# Altium project DClassAmp.PrjPcb (part 1 of 2)
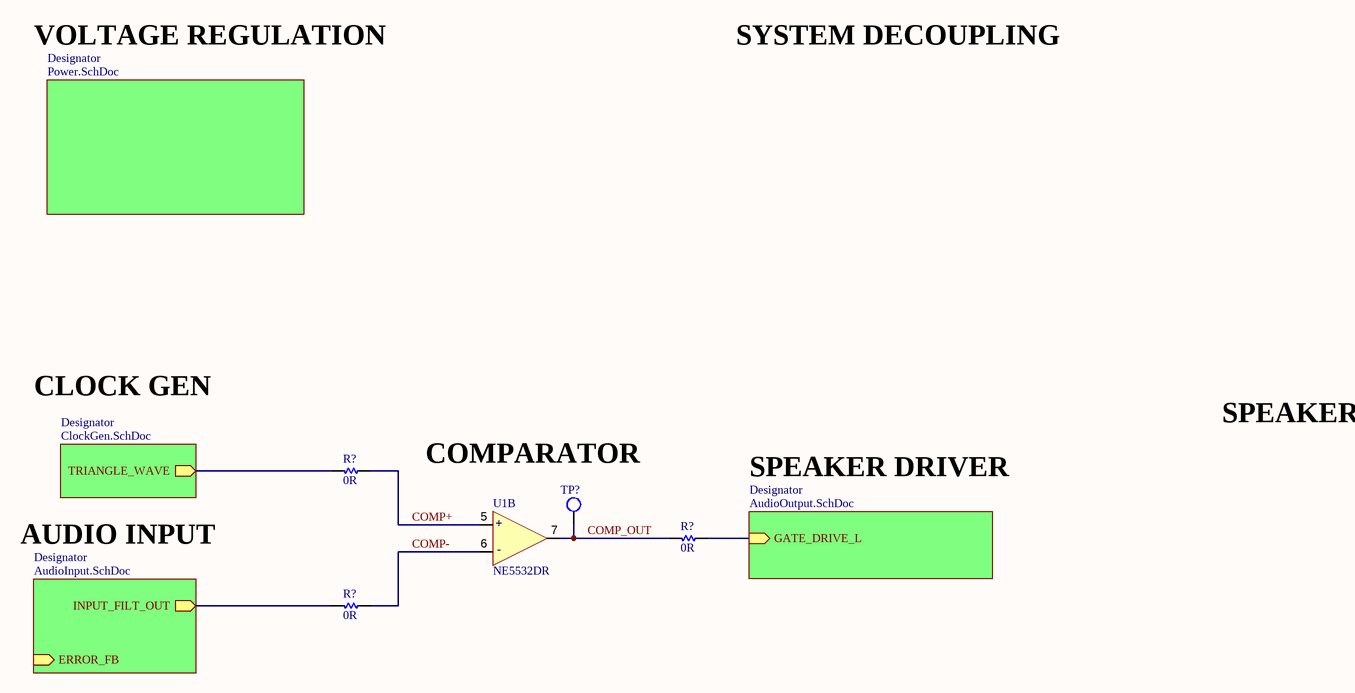
[diagram p0: DClassAmp.SchDoc]
5 sheets, 100 parts. Net scope: hierarchical (ports join the sheet entries above them; power ports are global).
Sheets:
  DClassAmp.SchDoc
    Designator = AudioInput.SchDoc
    Designator = ClockGen.SchDoc
    Designator = AudioOutput.SchDoc
    Designator = Power.SchDoc

## Sheet DClassAmp.SchDoc: D Class Amplifier
size 431 x 279 mm; CheckedBy: K.Heyer; DrawnBy: K.Heyer; Organization: ORGANIZATION; Address1: 207; Address2: 13399 104 Ave; Address3: Surrey BC, V3T 0C9; Address4: Canada; Revision: V0.0.0; SheetNumber: 1; SheetTotal: 5; Project: D Class Amp; ENG_APP_DATE: --/--/--; DSN_APP_DATE: --/--/--; CHK_APP_DATE: --/--/--

### Parts
(Parts that share a designator on the sheet are numbered #1, #2 ... from top to bottom, then left to right.)
R?#1  0R  [R0402]
R?#2  0R  [R0402]
R?#3  0R  [R0402]
TP?#1  1mm  [TESTPOINT_SMT]  (value not drawn)
U1  NE5532DR  [SO8 6.2x5mm TI D0008A]  (part B of 2)

### Sub-sheets
Designator = AudioInput.SchDoc: INPUT_FILT_OUT (out), ERROR_FB (in)
Designator = ClockGen.SchDoc: TRIANGLE_WAVE (out)
Designator = AudioOutput.SchDoc: GATE_DRIVE_L (in)
Designator = Power.SchDoc: no entries

### Nets
COMP+: R?#1.1 U1.5(+)
COMP-: R?#3.1 U1.6(-)
COMP_OUT: R?#2.2 TP?#1.1 U1.7
INPUT_FILT_OUT: R?#3.2 ; sheet Designator/INPUT_FILT_OUT
TRIANGLE_WAVE: R?#1.2 ; sheet Designator/TRIANGLE_WAVE
NetC?#24_2: R?#2.1 ; sheet Designator/GATE_DRIVE_L

### Notes on the sheet
- VOLTAGE REGULATION
- SYSTEM DECOUPLING
- CLOCK GEN
- COMPARATOR
- SPEAKER DRIVER
- SPEAKER
- AUDIO INPUT
- REV:
- PROJECT:
- DATE:
- TITLE
- SHEET
- OF
- DESIGNED:
- REVIEWED:

### Library data of the parts
R?#1-R?#3 = RES 0R 63mW 0402: GLOVE, POLYAMIDE, L/FREE, PU, SIZE 6 - More Details; Manufacturer: Stackpole Electronics; Manufacturer Part Number: RMCF0402ZT0R00; Power Rating: 63mW; Current Rating: 1A; Working Voltage: 50V; Supplier 1: Digi-Key; RoHS: Yes; Category: Chip SMD Resistors; Stock 1: 5203223; Pricing 1: 1=0.10000, 10=0.01000, 25=0.00720, 50=0.00560, 100=0.00410, 250=0.00316, 500=0.00252, 1000=0.00186, 5000=0.00133 (USD); Mount: Surface Mount; Case/Package: 0402; Case Code (Metric): 1005; Case Code (Imperial): 0402; Contact Plating: Tin,Matte; Min Operating Temperature: -55°C; Max Operating Temperature: 155°C; Resistance: 0R; Packaging: Tape and Reel; Resistor Type: Thick Film; Number of Terminations: 2; Max Power Dissipation: 63mW; Features: Automotive AEC-Q200; Series: RMCF; Technology: THICK FILM; Construction: Rectangular; Length: 0.039inch; Width: 0.02inch; Height: 0.016inch; Depth: 0.5mm; Radiation Hardening: No; Military Standard: Not; Lead Free: Lead Free; RoHS Compliant: Yes; ComponentLink1URL: https://datasheet.ciiva.com/26835/getdatasheetpartid-409751-26835612.pdf?src-supplier=Verical; ComponentLink1Description: https://datasheet.ciiva.com/26835/getdatasheetpartid-409751-26835612.pdf?src-supplier=Verical; Supplier Part Number 1: RMCF0402ZT0R00CT-ND
TP?#1 = TP 1mm: SMT testpoint
U1 = IC OPAMP AUDIO NE5532DR: 2-channel, 10-MHz, 26-V output swing, low-noise audio op amp 8-SOIC 0 to 70; Manufacturer: Texas Instruments; Voltage Gain: 100dB; Min Dual Supply Voltage: 5V; Max Dual Supply Voltage: 15V; Output Current: 38mA; Nominal Supply Current: 16mA; Common Mode Rejection Ratio: 70dB; Number of Channels: 2; Slew Rate: 9V/µs; Gain Bandwidth Product: 10MHz; Input Bias Current: 800nA; Input Offset Voltage (Vos): 4mV; Operating Supply Current: 8mA; Dual Supply Voltage: 9V; Supplier 1: Digi-Key; Manufacturer Part Number: NE5532DR; RoHS: Yes; Category: Amplifiers - Op Amps, Buffer, Instrumentation; Stock 1: 29111; Pricing 1: 1=0.60000, 10=0.51300, 25=0.47840, 100=0.38290, 250=0.35552, 500=0.30082, 1000=0.23246 (USD); Case/Package: D; Number of Pins: 8; Contact Plating: Gold; Min Operating Temperature: 0°C; Max Operating Temperature: 70°C; Packaging: Tape and Reel; Package Quantity: 1; Number of Circuits: 2; Output Current per Channel: 38mA; Nominal Gain Bandwidth Product: 10MHz; Unity Gain Bandwidth Product: 10MHz; Number of Elements: 2; Bandwidth: 10MHz; Max I/O Voltage: 4mV; Max Supply Voltage: 15V; Number of Amplifiers: 2; Length: 4.9mm; Width: 3.91mm; Height: 1.58mm; Radiation Hardening: No; Lead Free: Lead Free; RoHS Compliant: Yes; REACH SVHC: No SVHC; ComponentLink1URL: https://datasheet.ciiva.com/1796/ne5532-1796190.pdf?src-supplier=Digi-Key; ComponentLink1Description: https://datasheet.ciiva.com/1796/ne5532-1796190.pdf?src-supplier=Digi-Key; ComponentLink2URL: https://datasheet.ciiva.com/1796/ne5532-1796189.pdf?src-supplier=Digi-Key; ComponentLink2Description: https://datasheet.ciiva.com/1796/ne5532-1796189.pdf?src-supplier=Digi-Key; ComponentLink3URL: https://datasheet.ciiva.com/1796/ne5532-1796191.pdf?src-supplier=Digi-Key; ComponentLink3Description: https://datasheet.ciiva.com/1796/ne5532-1796191.pdf?src-supplier=Digi-Key; Supplier Part Number 1: 296-13622-1-ND

## Sheet AudioInput.SchDoc
size 431 x 279 mm; Organization: ORGANIZATION; Address1: 207; Address2: 13399 104 Ave; Address3: Surrey BC, V3T 0C9; Address4: Canada; Revision: V0.0.0; SheetNumber: 3; SheetTotal: 5; ENG_APP_DATE: --/--/--; DSN_APP_DATE: --/--/--; CHK_APP_DATE: --/--/--
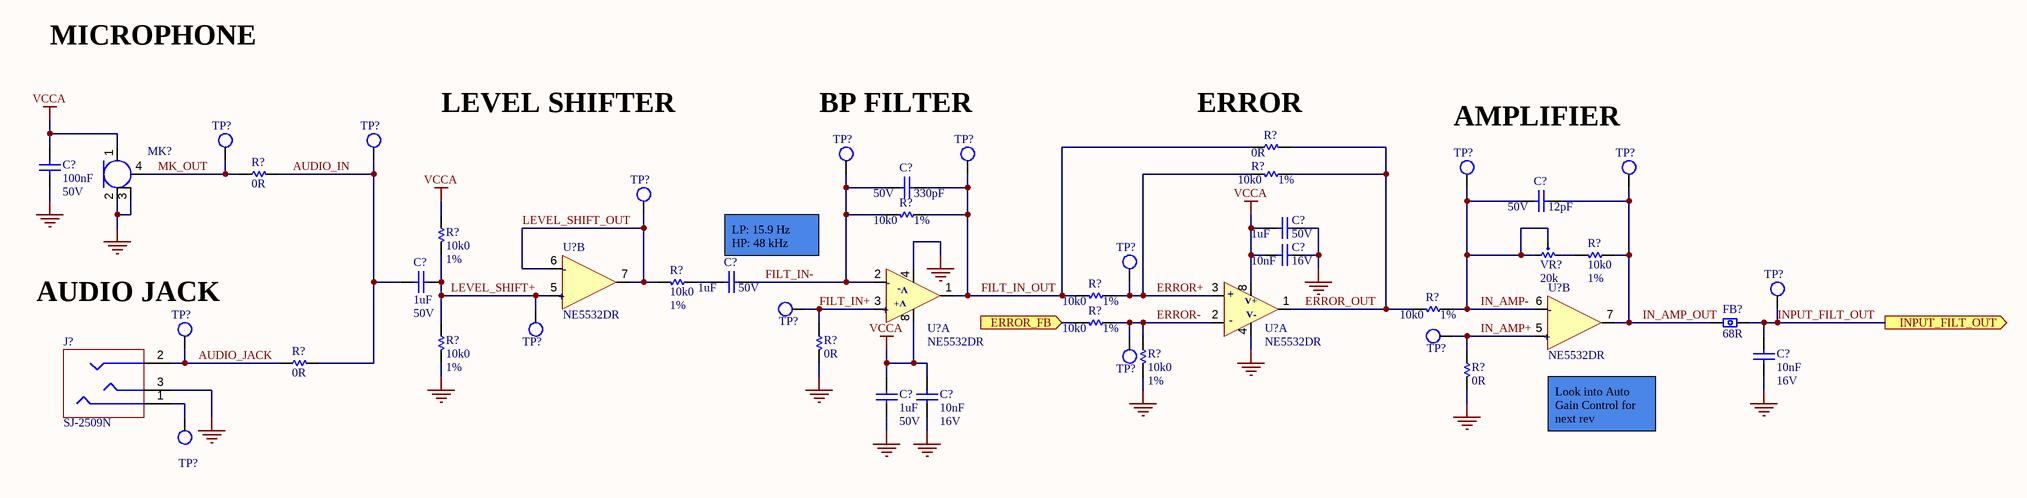
[diagram p1: AudioInput.SchDoc]

### Parts
(Parts that share a designator on the sheet are numbered #1, #2 ... from top to bottom, then left to right.)
C?#1  100nF  Voltage Rating: 50V  [C1206]
C?#2  330pF  Voltage Rating: 50V  [c0402]
C?#3  12pF  Voltage: 50V  [C0402]
C?#4  1uF  Voltage Rating: 50V
C?#5  10nF  Voltage Rating: 16V  [c0402]
C?#6  1uF  Voltage Rating: 50V
C?#7  1uF  Voltage Rating: 50V
C?#8  10nF  Voltage Rating: 16V  [c0402]
C?#9  1uF  Voltage Rating: 50V
C?#10  10nF  Voltage Rating: 16V  [c0402]
FB?  68R  [FB0402]
J?  SJ-2509N  [CONN SPKR JACK SJ-2509N]
MK?  CMM-2718AT-42308-TR  [MICROPHONE MEMS SMD CMM-2718AT-42308-TR]  (value not drawn)
R?#4  0R  [R0402]
R?#5  0R  [R0402]
R?#6  10k0  Tolerance: 1%  [r0402]
R?#7  10k0  Tolerance: 1%  [r0402]
R?#8  10k0  Tolerance: 1%  [r0402]
R?#9  10k0  Tolerance: 1%  [r0402]
R?#10  10k0  Tolerance: 1%  [r0402]
R?#11  10k0  Tolerance: 1%  [r0402]
R?#12  10k0  Tolerance: 1%  [r0402]
R?#13  10k0  Tolerance: 1%  [r0402]
R?#14  10k0  Tolerance: 1%  [r0402]
R?#15  0R  [R0402]
R?#16  10k0  Tolerance: 1%  [r0402]
R?#17  0R  [R0402]
R?#18  0R  [R0402]
TP?#2  1mm  [TESTPOINT_SMT]  (value not drawn)
TP?#3  1mm  [TESTPOINT_SMT]  (value not drawn)
TP?#4  1mm  [TESTPOINT_SMT]  (value not drawn)
TP?#5  1mm  [TESTPOINT_SMT]  (value not drawn)
TP?#6  1mm  [TESTPOINT_SMT]  (value not drawn)
TP?#7  1mm  [TESTPOINT_SMT]  (value not drawn)
TP?#8  1mm  [TESTPOINT_SMT]  (value not drawn)
TP?#9  1mm  [TESTPOINT_SMT]  (value not drawn)
TP?#10  1mm  [TESTPOINT_SMT]  (value not drawn)
TP?#11  1mm  [TESTPOINT_SMT]  (value not drawn)
TP?#12  1mm  [TESTPOINT_SMT]  (value not drawn)
TP?#13  1mm  [TESTPOINT_SMT]  (value not drawn)
TP?#14  1mm  [TESTPOINT_SMT]  (value not drawn)
TP?#15  1mm  [TESTPOINT_SMT]  (value not drawn)
TP?#16  1mm  [TESTPOINT_SMT]  (value not drawn)
U?#1  NE5532DR  [SO8 6.2x5mm TI D0008A]  (part B of 2)
U?#2  NE5532DR  [SO8 6.2x5mm TI D0008A]  (part A of 2)
U?#3  NE5532DR  [SO8 6.2x5mm TI D0008A]  (part A of 2)
U?#4  NE5532DR  [SO8 6.2x5mm TI D0008A]  (part B of 2)
VR?#1  20k  [RV TC33X-2]

### Ports
ERROR_FB (in), INPUT_FILT_OUT (out)

### Nets
GND: C?#1.1 C?#4.1 C?#5.1 C?#8.1 C?#9.1 C?#10.1 J?.3 MK?.2 MK?.3 R?#14.2 R?#15.2 R?#16.2 R?#18.2 U?#2.4(V-) U?#3.4(V-)
VCCA: C?#1.2 C?#4.2 C?#5.2 C?#9.2 C?#10.2 MK?.1 R?#8.1 U?#2.8(V+) U?#3.8(V+)
AUDIO_IN: C?#6.2 R?#5.2 R?#17.2 TP?#3.1
AUDIO_JACK: J?.2 R?#17.1 TP?#15.1
ERROR+: R?#6.2 R?#11.1 TP?#9.1 U?#3.3(+)
ERROR-: R?#13.1 R?#16.1 TP?#13.1 U?#3.2(-)
ERROR_OUT: R?#4.2 R?#6.1 R?#12.2 U?#3.1
FILT_IN+: R?#15.1 TP?#11.1 U?#2.3(+)
FILT_IN-: C?#2.2 C?#7.1 R?#7.2 TP?#4.1 U?#2.2(-)
FILT_IN_OUT: C?#2.1 R?#4.1 R?#7.1 R?#11.2 TP?#5.1 U?#2.1
IN_AMP+: R?#18.1 TP?#14.1 U?#4.5(+)
IN_AMP-: C?#3.2 R?#12.1 TP?#6.1 U?#4.6(-) VR?#1.1 VR?#1.3
IN_AMP_OUT: C?#3.1 FB?.1 R?#9.1 TP?#7.1 U?#4.7
INPUT_FILT_OUT: C?#8.2 FB?.2 TP?#12.1 ; port INPUT_FILT_OUT
LEVEL_SHIFT+: C?#6.1 R?#8.2 R?#14.1 TP?#10.1 U?#1.5(+)
LEVEL_SHIFT_OUT: R?#10.2 TP?#8.1 U?#1.6(-) U?#1.7
MK_OUT: MK?.4 R?#5.1 TP?#2.1
NetC?#7_2: C?#7.2 R?#10.1
NetJ?_1: J?.1 TP?#16.1
NetR?#9_2: R?#9.2 VR?#1.3
NetR?#13_2: R?#13.2 ; port ERROR_FB

### Notes on the sheet
- MICROPHONE
- LEVEL SHIFTER
- (near TP?#4) BP FILTER
- (near R?#4) ERROR
- (near TP?#6) AMPLIFIER
- (near C?#7) LP: 15.9 Hz
  HP: 48 kHz
- (near TP?#15) AUDIO JACK
- (near U?#4) Look into Auto Gain Control for next rev
- REV:
- PROJECT:
- DATE:
- TITLE
- SHEET
- OF
- DESIGNED:
- REVIEWED:

### Library data of the parts
C?#1 = CAP CER 100nF 50V X7R 1206: Capacitor, ceramic, 100Nf, 50Vdc, 10-% Tol, 10+% Tol, x7R-Tc Code, -15, 15%-Tc Rohs Compliant: Yes; Manufacturer: KEMET; Manufacturer Part Number: C1206C104K5RAC7210; Tolerance: 10%; Dielectric: X7R; Supplier 1: Digi-Key; RoHS: Yes; Category: Ceramic Capacitors; Stock 1: 510000; Pricing 1: 10000=0.01725 (USD); Mount: Surface Mount; Case/Package: 1206; Case Code (Imperial): 1206; Case Code (Metric): 3216; Dielectric Material: Ceramic; Min Operating Temperature: -55°C; Max Operating Temperature: 125°C; Capacitance: 100nF; Packaging: Tape and Reel; Package Quantity: 10000; Voltage Rating (DC): 50V; Termination: SMD/SMT; Series: C; Construction: Flat; Length: 3.2mm; Width: 1.6mm; Height: 0.78mm; Depth: 1.6mm; Thickness: 0.035inch; Radiation Hardening: No; RoHS Compliant: Yes; ComponentLink1URL: https://datasheet.ciiva.com/16623/datasheetpn-c1206c104k5rac7210-16623777.pdf?src-supplier=Avnet+Europe; ComponentLink1Description: https://datasheet.ciiva.com/16623/datasheetpn-c1206c104k5rac7210-16623777.pdf?src-supplier=Avnet+Europe; ComponentLink2URL: https://datasheet.ciiva.com/18194/getdatasheetpartid-94372-18194154.pdf?src-supplier=Verical; ComponentLink2Description: https://datasheet.ciiva.com/18194/getdatasheetpartid-94372-18194154.pdf?src-supplier=Verical; Supplier Part Number 1: 399-7357-2-ND
C?#2 = CAP CER 330pF 50V C0G 0402: Multilayer Ceramic Capacitor, 330 pF, 5%, C0G / NP0, 50 V, 0402 [1005 Metric] RoHS Compliant: Yes; Manufacturer: Walsin Technologies; Manufacturer Part Number: 0402N331J500CT; Supplier 1: Digi-Key; RoHS: Yes; Category: Ceramic Capacitors; Stock 1: 670585; Pricing 1: 1=0.10000, 10=0.02700, 50=0.01460, 100=0.01190, 500=0.00848, 1000=0.00666, 2500=0.00605, 5000=0.00557 (USD); Case/Package: 0402; Case Code (Metric): 1005; Case Code (Imperial): 0402; Min Operating Temperature: -55°C; Max Operating Temperature: 125°C; Tolerance: 5%; Packaging: Tape and Reel; Capacitance: 330pF; Dielectric: C0G; Voltage Rating (DC): 50V; Length: 1mm; Depth: 0.5mm; REACH SVHC: Unknown; RoHS Compliant: Yes; ComponentLink1URL: http://www.farnell.com/datasheets/1958513.pdf?src-supplier=Farnell; ComponentLink1Description: http://www.farnell.com/datasheets/1958513.pdf?src-supplier=Farnell; ComponentLink2URL: http://www.farnell.com/datasheets/2340522.pdf?src-supplier=Farnell; ComponentLink2Description: http://www.farnell.com/datasheets/2340522.pdf?src-supplier=Farnell; ComponentLink3URL: http://components.arrow.com/part/dataview/0323_03460079?src-supplier=Arrow+Europe; ComponentLink3Description: http://components.arrow.com/part/dataview/0323_03460079?src-supplier=Arrow+Europe; ComponentLink4URL: http://www.farnell.com/datasheets/1958513.pdf?src-supplier=Element14; ComponentLink4Description: http://www.farnell.com/datasheets/1958513.pdf?src-supplier=Element14; ComponentLink5URL: http://www.passivecomponent.com/wp-content/uploads/2018/10/MLCC.pdf?src-supplier=Digi-Key; ComponentLink5Description: http://www.passivecomponent.com/wp-content/uploads/2018/10/MLCC.pdf?src-supplier=Digi-Key; Supplier Part Number 1: 1292-1308-1-ND
C?#3 = CAP CER 12pF 50V C0G 0402: Ceramic capacitor SMD-0402 12pF /50V C0G# J +-5%, Samsung, RoHS; Manufacturer Part Number: CL05C120JB5NNNC; Tolerance: 5%; Dielectric: C0G; Temperature Coefficient: 300ppm/°C; Supplier 1: Digi-Key; Manufacturer: Samsung; RoHS: Yes; Category: Ceramic Capacitors; Stock 1: 41998; Pricing 1: 10000=0.00386, 20000=0.00367 (USD); Mount: Surface Mount; Case/Package: 0402; Case Code (Metric): 1005; Case Code (Imperial): 0402; Material: Ceramic; Contact Plating: Tin; Min Operating Temperature: -55°C; Max Operating Temperature: 125°C; Capacitance: 12pF; Package Quantity: 1; Packaging: Tape and Reel; Voltage Rating: 50V; Series: CL; Construction: Flat; Voltage Rating (DC): 50V; Length: 1mm; Width: 0.02inch; Height: 0.5mm; Thickness: 0.022inch; Depth: 0.5mm; Radiation Hardening: No; RoHS Compliant: Yes; Lead Free: Lead Free; ComponentLink1URL: https://datasheet.ciiva.com/25806/cl05c120jb5nnnc-25806484.pdf?src-supplier=Digi-Key; ComponentLink1Description: https://datasheet.ciiva.com/25806/cl05c120jb5nnnc-25806484.pdf?src-supplier=Digi-Key; ComponentLink2URL: https://datasheet.ciiva.com/26838/getdatasheetpartid-658047-26838280.pdf?src-supplier=Verical; ComponentLink2Description: https://datasheet.ciiva.com/26838/getdatasheetpartid-658047-26838280.pdf?src-supplier=Verical; ComponentLink3URL: https://datasheet.ciiva.com/29198/458703-da-01-en-vs-kondensator-0402-29198421.pdf?src-supplier=Conrad; ComponentLink3Description: https://datasheet.ciiva.com/29198/458703-da-01-en-vs-kondensator-0402-29198421.pdf?src-supplier=Conrad; ComponentLink4URL: https://datasheet.ciiva.com/16449/cl05b104kq5nnnc-16449055.pdf?src-supplier=Future+Electronics; ComponentLink4Description: https://datasheet.ciiva.com/16449/cl05b104kq5nnnc-16449055.pdf?src-supplier=Future+Electronics; Supplier Part Number 1: 1276-1178-2-ND
C?#4 C?#6 C?#7 C?#9 = CAP CER 1uF 50V X5R 0603: Multilayer Ceramic Capacitors (High dielectric type), 50V, 1 uF, ± 10 %, 0603, X5R, RoHS; Manufacturer: Taiyo Yuden; Manufacturer Part Number: UMK107BJ105KA-T; Tolerance: 10%; Supplier 1: Digi-Key; RoHS: Yes; Category: Ceramic Capacitors; Stock 1: 955108; Pricing 1: 1=0.19000, 10=0.12900, 50=0.07760, 100=0.06560, 500=0.04484, 1000=0.03968 (USD); Mount: Surface Mount; Case/Package: 0603; Number of Pins: 2; Case Code (Metric): 1608; Case Code (Imperial): 0603; Contact Plating: Nickel; Min Operating Temperature: -55°C; Max Operating Temperature: 85°C; Capacitance: 1uF; Packaging: Tape and Reel; Package Quantity: 1; Dielectric: X5R; Voltage Rating (DC): 50V; Termination: SMD/SMT; Series: M; Construction: Flat; Length: 1.6mm; Width: 0.031inch; Height: 0.8mm; Depth: 0.8mm; Thickness: 0.035inch; Radiation Hardening: No; RoHS Compliant: Yes; REACH SVHC: Unknown; Halogen Free: Halogen Free; ComponentLink1URL: https://datasheet.ciiva.com/134/umk107bj105ka-t-ss-134740.pdf?src-supplier=Digi-Key; ComponentLink1Description: https://datasheet.ciiva.com/134/umk107bj105ka-t-ss-134740.pdf?src-supplier=Digi-Key; ComponentLink2URL: https://datasheet.ciiva.com/11601/umk107bj105ka-t-ss-11601811.pdf?src-supplier=Avnet; ComponentLink2Description: https://datasheet.ciiva.com/11601/umk107bj105ka-t-ss-11601811.pdf?src-supplier=Avnet; ComponentLink3URL: https://datasheet.ciiva.com/5744/1697715-5744913.pdf?src-supplier=Farnell; ComponentLink3Description: https://datasheet.ciiva.com/5744/1697715-5744913.pdf?src-supplier=Farnell; ComponentLink4URL: https://datasheet.ciiva.com/30199/43umk107bj105ka-t-30199791.pdf?src-supplier=Onlinecomponents.com; ComponentLink4Description: https://datasheet.ciiva.com/30199/43umk107bj105ka-t-30199791.pdf?src-supplier=Onlinecomponents.com; ComponentLink5URL: https://datasheet.ciiva.com/15922/336umk107bj105ka-t-15922611.pdf?src-supplier=Onlinecomponents.com; ComponentLink5Description: https://datasheet.ciiva.com/15922/336umk107bj105ka-t-15922611.pdf?src-supplier=Onlinecomponents.com; ComponentLink6URL: https://datasheet.ciiva.com/5427/mlcc-all-e-541559-5427036.pdf?src-supplier=Mouser; ComponentLink6Description: https://datasheet.ciiva.com/5427/mlcc-all-e-541559-5427036.pdf?src-supplier=Mouser; ComponentLink7URL: https://datasheet.ciiva.com/7975/mlcc-all-e-7975898.pdf?src-supplier=Element14; ComponentLink7Description: https://datasheet.ciiva.com/7975/mlcc-all-e-7975898.pdf?src-supplier=Element14; ComponentLink8URL: https://datasheet.ciiva.com/7975/1697715-7975608.pdf?src-supplier=Element14; ComponentLink8Description: https://datasheet.ciiva.com/7975/1697715-7975608.pdf?src-supplier=Element14; ComponentLink9URL: https://datasheet.ciiva.com/22694/1697715-22694278.pdf?src-supplier=Element14; ComponentLink9Description: https://datasheet.ciiva.com/22694/1697715-22694278.pdf?src-supplier=Element14; Supplier Part Number 1: 587-2400-1-ND
C?#5 C?#8 C?#10 = CAP CER 10nF 16V Y5V 0402: 0402 10 nF 16 V -20 / +80 % Tolerance Y5V SMT Multilayer Ceramic Capacitor; Manufacturer: Yageo; Manufacturer Part Number: CC0402ZRY5V7BB103; Tolerance: 80%; Insulation Resistance: 100GR; Supplier 1: Future Electronics; RoHS: Yes; Category: Ceramic Capacitors; Stock 1: 10000; Pricing 1: 10000=0.00340, 30000=0.00320, 100000=0.00300, 200000=0.00290, 400000=0.00270 (USD); Mount: Surface Mount; Case/Package: 0402; Number of Pins: 2; Case Code (Imperial): 0402; Case Code (Metric): 1005; Dielectric Material: Ceramic; Min Operating Temperature: -55°C; Max Operating Temperature: 85°C; Capacitance: 10nF; Packaging: Tape and Reel; Voltage Rating (DC): 16V; Dielectric: Y5V; Termination: SMD/SMT; Series: CC; Package Quantity: 10000; Construction: Flat; Length: 1mm; Width: 0.02inch; Height: 0.5mm; Depth: 0.5mm; Thickness: 0.022inch; Terminal Length: 0.225mm; Radiation Hardening: No; RoHS Compliant: Yes; Lead Free: Lead Free; REACH SVHC: No SVHC; Halogen Free: Halogen Free; ComponentLink1URL: https://datasheet.ciiva.com/144/mlccorderingcode-144484.pdf?src-supplier=Digi-Key; ComponentLink1Description: https://datasheet.ciiva.com/144/mlccorderingcode-144484.pdf?src-supplier=Digi-Key; ComponentLink2URL: https://datasheet.ciiva.com/144/mlccorderingcode-144485.pdf?src-supplier=Digi-Key; ComponentLink2Description: https://datasheet.ciiva.com/144/mlccorderingcode-144485.pdf?src-supplier=Digi-Key; ComponentLink3URL: https://datasheet.ciiva.com/144/mlccorderingcode-144486.pdf?src-supplier=Digi-Key; ComponentLink3Description: https://datasheet.ciiva.com/144/mlccorderingcode-144486.pdf?src-supplier=Digi-Key; ComponentLink4URL: https://datasheet.ciiva.com/11586/upy-gphc-y5v-6-3v-to-50v-5-11586517.pdf?src-supplier=Avnet; ComponentLink4Description: https://datasheet.ciiva.com/11586/upy-gphc-y5v-6-3v-to-50v-5-11586517.pdf?src-supplier=Avnet; ComponentLink5URL: https://datasheet.ciiva.com/5789/1132289-5789565.pdf?src-supplier=Farnell; ComponentLink5Description: https://datasheet.ciiva.com/5789/1132289-5789565.pdf?src-supplier=Farnell; ComponentLink6URL: https://datasheet.ciiva.com/5789/1132289-5789566.pdf?src-supplier=Farnell; ComponentLink6Description: https://datasheet.ciiva.com/5789/1132289-5789566.pdf?src-supplier=Farnell; ComponentLink7URL: https://datasheet.ciiva.com/17437/upy-gphc-y5v-6-3v-to-50v-5-17437221.pdf?src-supplier=Avnet+Europe; ComponentLink7Description: https://datasheet.ciiva.com/17437/upy-gphc-y5v-6-3v-to-50v-5-17437221.pdf?src-supplier=Avnet+Europe; ComponentLink8URL: https://datasheet.ciiva.com/8033/1132289-8033641.pdf?src-supplier=Element14; ComponentLink8Description: https://datasheet.ciiva.com/8033/1132289-8033641.pdf?src-supplier=Element14; ComponentLink9URL: https://datasheet.ciiva.com/8033/1132289-8033642.pdf?src-supplier=Element14; ComponentLink9Description: https://datasheet.ciiva.com/8033/1132289-8033642.pdf?src-supplier=Element14; Supplier Part Number 1: 1300987
FB? = FB 68R 400mA 310mR 0402: Ferrite Beads Multi-Layer 68Ohm 25% 100MHz 400mA 310mOhm DCR 0402 T/R; Manufacturer: Taiyo Yuden; Manufacturer Part Number: BK1005LL680-T; DC Resistance (DCR): 310mR; Number of Lines: 1; Shielding: Unshielded; Supplier 1: Digi-Key; RoHS: Yes; Category: Ferrite Beads and Chips; Stock 1: 9707; Pricing 1: 1=0.10000, 10=0.04100, 25=0.03640, 50=0.03300, 100=0.02970, 250=0.02176, 500=0.01584, 1000=0.01551, 5000=0.01056 (USD); Mount: Surface Mount; Case/Package: 0402; Number of Pins: 2; Case Code (Metric): 1005; Case Code (Imperial): 0402; Core Material: Ferrite; Min Operating Temperature: -55°C; Max Operating Temperature: 125°C; Packaging: Tape and Reel; Package Quantity: 1; Impedance: 68R; Tolerance: 25%; Max DC Current: 400mA; Termination: SMD/SMT; Test Frequency: 100MHz; Max Current Rating: 400mA; Series: BK; Frequency: 100MHz; Length: 0.039inch; Width: 0.02inch; Height: 0.022inch; Depth: 0.55mm; Halogen Free: Halogen Free; Lead Free: Lead Free; REACH SVHC: Unknown; ComponentLink1URL: https://datasheet.ciiva.com/1013/bk1005ll680-t-ss-1013936.pdf?src-supplier=Digi-Key; ComponentLink1Description: https://datasheet.ciiva.com/1013/bk1005ll680-t-ss-1013936.pdf?src-supplier=Digi-Key; ComponentLink2URL: https://datasheet.ciiva.com/1013/mlci07-e-1013935.pdf?src-supplier=Digi-Key; ComponentLink2Description: https://datasheet.ciiva.com/1013/mlci07-e-1013935.pdf?src-supplier=Digi-Key; ComponentLink3URL: https://datasheet.ciiva.com/1013/mlci07-e-1013937.pdf?src-supplier=Digi-Key; ComponentLink3Description: https://datasheet.ciiva.com/1013/mlci07-e-1013937.pdf?src-supplier=Digi-Key; Supplier Part Number 1: 587-1860-1-ND
J? = CONN SPKR JACK RA TH SJ-2509N: 2.5 mm, Stereo, Right Angle, Through Hole, Audio Jack Connector; Manufacturer: CUI Devices; Supplier 1: Digi-Key; Manufacturer Part Number: SJ-2509N; RoHS: Yes; Category: Audio / Video Connectors; Stock 1: 21425; Pricing 1: 1=0.73000, 10=0.63300, 25=0.57880, 50=0.54480, 100=0.52210, 250=0.47664, 500=0.45396, 1000=0.37452, 2500=0.34047 (USD); Supplier Part Number 1: CP-S2509N-ND
MK? = MICROPHONE MEMS SMD CMM-2718AT-42308-TR: 2.75 x 1.85 mm, Analog, Top Port, Surface Mount, 2.0 Vdc, -42 ±3 dB, MEMS Microphone; Manufacturer: CUI Devices; Supplier 1: Digi-Key; Manufacturer Part Number: CMM-2718AT-42308-TR; RoHS: Yes; Category: Microphones; Stock 1: 1358; Pricing 1: 1=0.88000, 10=0.73800, 25=0.68360, 50=0.64380, 100=0.60560, 500=0.52196 (USD); RoHS Compliant: Yes; Supplier Part Number 1: 102-5092-1-ND
R?#4 R?#5 R?#15 R?#17 R?#18 = RES 0R 63mW 0402: as R?#1 on sheet DClassAmp; Supplier 1: Digi-Key; RoHS: Yes; Category: Chip SMD Resistors; Stock 1: 5203223; Pricing 1: 1=0.10000, 10=0.01000, 25=0.00720, 50=0.00560, 100=0.00410, 250=0.00316, 500=0.00252, 1000=0.00186, 5000=0.00133 (USD); Mount: Surface Mount; Case/Package: 0402; Case Code (Metric): 1005; Case Code (Imperial): 0402; Contact Plating: Tin,Matte; Min Operating Temperature: -55°C; Max Operating Temperature: 155°C; Resistance: 0R; Packaging: Tape and Reel; Resistor Type: Thick Film; Number of Terminations: 2; Max Power Dissipation: 63mW; Features: Automotive AEC-Q200; Series: RMCF; Technology: THICK FILM; Construction: Rectangular; Length: 0.039inch; Width: 0.02inch; Height: 0.016inch; Depth: 0.5mm; Radiation Hardening: No; Military Standard: Not; Lead Free: Lead Free; RoHS Compliant: Yes; ComponentLink1URL: https://datasheet.ciiva.com/26835/getdatasheetpartid-409751-26835612.pdf?src-supplier=Verical; ComponentLink1Description: https://datasheet.ciiva.com/26835/getdatasheetpartid-409751-26835612.pdf?src-supplier=Verical; Supplier Part Number 1: RMCF0402ZT0R00CT-ND
R?#6-R?#14 R?#16 = RES 10k0 1% 63mW 0402: Res General Purpose Thick Film 0402 10K Ohm 1% 1/16W ±100ppm/°C Molded SMD Paper T/R; Manufacturer: Yageo; Manufacturer Part Number: RC0402FR-0710KL; Resistance: 10kR; Voltage Rating (DC): 50V; Power Rating: 62.5mW; Max Power Dissipation: 63mW; Supplier 1: RSComponents; RoHS: Yes; Category: Chip SMD Resistors; Stock 1: 29900; Pricing 1: 10000=0.00300 (GBP); Case/Package: 0402; Number of Pins: 2; Case Code (Imperial): 0402; Case Code (Metric): 1005; Min Operating Temperature: -55°C; Max Operating Temperature: 155°C; Resistor Type: Thick Film; Temperature Coefficient: 100ppm/°C; Packaging: Tape and Reel; Voltage Rating: 50V; Termination: SMD/SMT; Working Voltage: 50V; Number of Terminations: 2; Features: Moisture Resistant; Series: RC; Resistance Tolerance: 1%; Construction: Rectangular; Length: 1mm; Width: 0.5mm; Height: 0.32mm; Depth: 0.5mm; Lead Pitch: 0.2mm; REACH SVHC: No SVHC; Lead Free: Lead Free; RoHS Compliant: Yes; Military Standard: Not; ComponentLink1URL: https://datasheet.ciiva.com/7660/38568-7660787.pdf?src-supplier=Element14; ComponentLink1Description: https://datasheet.ciiva.com/7660/38568-7660787.pdf?src-supplier=Element14; ComponentLink2URL: https://datasheet.ciiva.com/12667/pyu-rc0402-51-rohs-l-6-r-12667067.pdf?src-supplier=Mouser; ComponentLink2Description: https://datasheet.ciiva.com/12667/pyu-rc0402-51-rohs-l-6-r-12667067.pdf?src-supplier=Mouser; ComponentLink3URL: https://datasheet.ciiva.com/7849/1784430-7849813.pdf?src-supplier=Element14; ComponentLink3Description: https://datasheet.ciiva.com/7849/1784430-7849813.pdf?src-supplier=Element14; ComponentLink4URL: https://datasheet.ciiva.com/7849/1686128-7849814.pdf?src-supplier=Element14; ComponentLink4Description: https://datasheet.ciiva.com/7849/1686128-7849814.pdf?src-supplier=Element14; ComponentLink5URL: https://datasheet.ciiva.com/7849/1784430-7849815.pdf?src-supplier=Element14; ComponentLink5Description: https://datasheet.ciiva.com/7849/1784430-7849815.pdf?src-supplier=Element14; ComponentLink6URL: https://datasheet.ciiva.com/7983/1018594-7983486.pdf?src-supplier=Element14; ComponentLink6Description: https://datasheet.ciiva.com/7983/1018594-7983486.pdf?src-supplier=Element14; ComponentLink7URL: https://datasheet.ciiva.com/22747/1018594-22747512.pdf?src-supplier=Element14; ComponentLink7Description: https://datasheet.ciiva.com/22747/1018594-22747512.pdf?src-supplier=Element14; Supplier Part Number 1: 1987643
TP?#2-TP?#16 = TP 1mm: SMT testpoint
U?#1-U?#4 = IC OPAMP AUDIO NE5532DR: as U1 on sheet DClassAmp; Supplier 1: Digi-Key; Manufacturer Part Number: NE5532DR; RoHS: Yes; Category: Amplifiers - Op Amps, Buffer, Instrumentation; Stock 1: 29111; Pricing 1: 1=0.60000, 10=0.51300, 25=0.47840, 100=0.38290, 250=0.35552, 500=0.30082, 1000=0.23246 (USD); Case/Package: D; Number of Pins: 8; Contact Plating: Gold; Min Operating Temperature: 0°C; Max Operating Temperature: 70°C; Packaging: Tape and Reel; Package Quantity: 1; Number of Circuits: 2; Output Current per Channel: 38mA; Nominal Gain Bandwidth Product: 10MHz; Unity Gain Bandwidth Product: 10MHz; Number of Elements: 2; Bandwidth: 10MHz; Max I/O Voltage: 4mV; Max Supply Voltage: 15V; Number of Amplifiers: 2; Length: 4.9mm; Width: 3.91mm; Height: 1.58mm; Radiation Hardening: No; Lead Free: Lead Free; RoHS Compliant: Yes; REACH SVHC: No SVHC; ComponentLink1URL: https://datasheet.ciiva.com/1796/ne5532-1796190.pdf?src-supplier=Digi-Key; ComponentLink1Description: https://datasheet.ciiva.com/1796/ne5532-1796190.pdf?src-supplier=Digi-Key; ComponentLink2URL: https://datasheet.ciiva.com/1796/ne5532-1796189.pdf?src-supplier=Digi-Key; ComponentLink2Description: https://datasheet.ciiva.com/1796/ne5532-1796189.pdf?src-supplier=Digi-Key; ComponentLink3URL: https://datasheet.ciiva.com/1796/ne5532-1796191.pdf?src-supplier=Digi-Key; ComponentLink3Description: https://datasheet.ciiva.com/1796/ne5532-1796191.pdf?src-supplier=Digi-Key; Supplier Part Number 1: 296-13622-1-ND
VR?#1 = TC33X-2-203E: Res Trimmer 20K Ohm 25% 1/10W 1(Elec)/1(Mech)Turn (3 X 3.8mm) Foot Print SMD Embossed T/R; Manufacturer: Bourns; Resistance: 20kR; Power Rating: 100mW; Number of Turns: 1; Temperature Coefficient: 250ppm/°C; Supplier 1: Digi-Key; Manufacturer Part Number: TC33X-2-203E; RoHS: Yes; Category: Variable Resistors and Potentiometers; Stock 1: 95244; Pricing 1: 1=0.26000, 10=0.25200, 25=0.22760, 50=0.21700, 100=0.21000, 250=0.19600, 500=0.17850, 1000=0.16100 (USD); Mount: Surface Mount; Min Operating Temperature: -40°C; Max Operating Temperature: 100°C; Tolerance: 25%; Packaging: Tape and Reel; Package Quantity: 2500; Resistor Type: Cermet; Termination: Foot Print; Max Power Dissipation: 100mW; Series: TC33; Resistance Tolerance: 25%; Length: 3mm; Width: 0.118inch; Height: 0.047inch; Depth: 3.8mm; Radiation Hardening: No; REACH SVHC: No SVHC; Military Standard: Not; RoHS Compliant: Yes; ComponentLink1URL: https://datasheet.ciiva.com/22671/1537288-22671216.pdf?src-supplier=Element14; ComponentLink1Description: https://datasheet.ciiva.com/22671/1537288-22671216.pdf?src-supplier=Element14; ComponentLink2URL: https://datasheet.ciiva.com/11833/0900766b802749b3-11833400.pdf?src-supplier=RSComponents; ComponentLink2Description: https://datasheet.ciiva.com/11833/0900766b802749b3-11833400.pdf?src-supplier=RSComponents; ComponentLink3URL: https://datasheet.ciiva.com/6227/tc33-6227117.pdf?src-supplier=Digi-Key; ComponentLink3Description: https://datasheet.ciiva.com/6227/tc33-6227117.pdf?src-supplier=Digi-Key; ComponentLink4URL: https://datasheet.ciiva.com/6227/tc33-6227118.pdf?src-supplier=Digi-Key; ComponentLink4Description: https://datasheet.ciiva.com/6227/tc33-6227118.pdf?src-supplier=Digi-Key; ComponentLink5URL: https://datasheet.ciiva.com/6227/tc33-6227119.pdf?src-supplier=Digi-Key; ComponentLink5Description: https://datasheet.ciiva.com/6227/tc33-6227119.pdf?src-supplier=Digi-Key; ComponentLink6URL: https://datasheet.ciiva.com/30078/tc33-30078556.pdf?src-supplier=Onlinecomponents.com; ComponentLink6Description: https://datasheet.ciiva.com/30078/tc33-30078556.pdf?src-supplier=Onlinecomponents.com; ComponentLink7URL: https://datasheet.ciiva.com/15156/getdatasheetpartid-128027-15156621.pdf?src-supplier=Verical; ComponentLink7Description: https://datasheet.ciiva.com/15156/getdatasheetpartid-128027-15156621.pdf?src-supplier=Verical; ComponentLink8URL: https://datasheet.ciiva.com/7953/1818686-7953350.pdf?src-supplier=Element14; ComponentLink8Description: https://datasheet.ciiva.com/7953/1818686-7953350.pdf?src-supplier=Element14; ComponentLink9URL: https://datasheet.ciiva.com/22718/1520225-22718588.pdf?src-supplier=Element14; ComponentLink9Description: https://datasheet.ciiva.com/22718/1520225-22718588.pdf?src-supplier=Element14; Supplier Part Number 1: TC33X-2-203ECT-ND